# Altium schematic sheet GPS.SchDoc
size A4; SheetNumber: 8; SheetTotal: 13
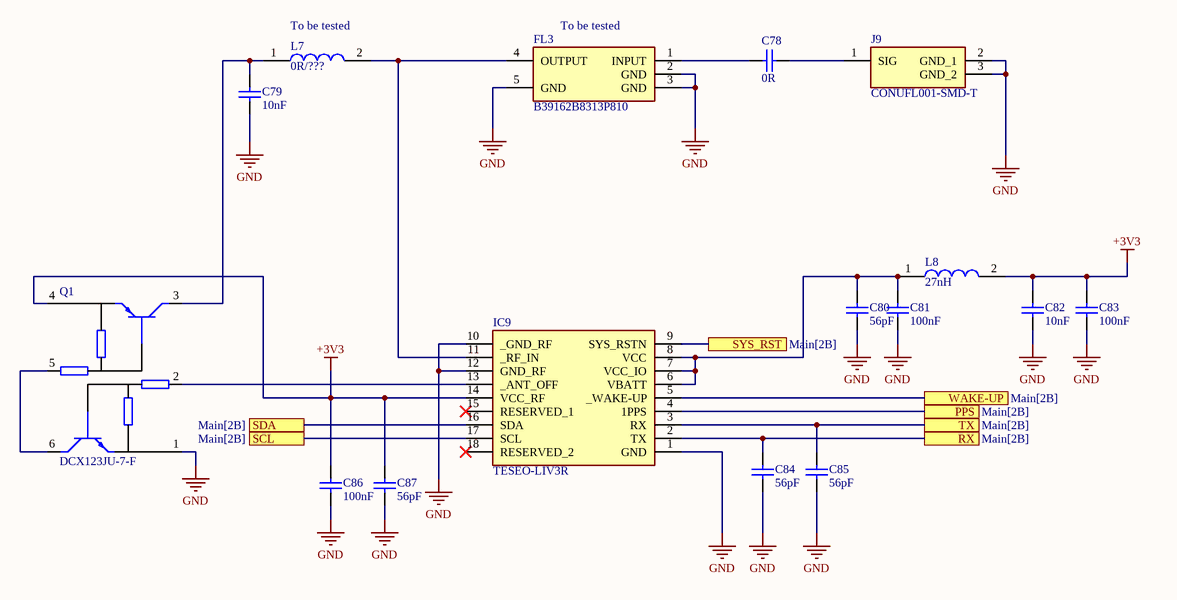
[diagram p0: GPS.SchDoc]

## Parts
C78  value 0R  [CAP0402]  (hidden comment: Cap0402)
C79  value 10nF  [CAP0402]  (hidden comment: Cap0402)
C80  value 56pF  [CAP0402]  (hidden comment: Cap0402)
C81  value 100nF  [CAP0402]  (hidden comment: Cap0402)
C82  value 10nF  [CAP0402]  (hidden comment: Cap0402)
C83  value 100nF  [CAP0402]  (hidden comment: Cap0402)
C84  value 56pF  [CAP0402]  (hidden comment: Cap0402)
C85  value 56pF  [CAP0402]  (hidden comment: Cap0402)
C86  value 100nF  [CAP0402]  (hidden comment: Cap0402)
C87  value 56pF  [CAP0402]  (hidden comment: Cap0402)
FL3  B39162B8313P810  [B39162B8313P810]
IC9  TESEO-LIV3R  [TESEOLIV3R]
J9  CONUFL001-SMD-T  [CONUFL001-SMD]
L7  value 0R/???  [INDC1005X55N]  (hidden comment: LQG15HS27NJ02)
L8  value 27nH  [INDC1005X55N]  (hidden comment: LQG15HS27NJ02)
Q1  DCX123JU-7-F  [SOT65P210X110-6N]

## Ports
PPS (see Main[2B]), RX (see Main[2B]), SCL (see Main[2B]), SDA (see Main[2B]), SYS_RST (see Main[2B]), TX (see Main[2B]), WAKE-UP (see Main[2B])

## Nets
+3V3: C82.2 C83.2 C86.2 C87.2 IC9.14(VCC_RF) L8.2 Q1.4(E)
GND: C79.1 C80.1 C81.1 C82.1 C83.1 C84.1 C85.1 C86.1 C87.1 FL3.2(GND) FL3.3(GND) FL3.5(GND) IC9.1(GND) IC9.10(_GND_RF) IC9.12(GND_RF) J9.2(GND_1) J9.3(GND_2) Q1.1(E)
PPS: IC9.4(1PPS) ; port PPS
RX: C84.2 IC9.2(TX) ; port RX
SCL: IC9.17(SCL) ; port SCL
SDA: IC9.16(SDA) ; port SDA
SYS_RST: IC9.9(SYS_RSTN) ; port SYS_RST
TX: C85.2 IC9.3(RX) ; port TX
WAKE-UP: IC9.5(_WAKE-UP) ; port WAKE-UP
NetC78_1: C78.1 J9.1(SIG)
NetC78_2: C78.2 FL3.1(INPUT)
NetC79_2: C79.2 L7.1 Q1.3(C)
NetC80_2: C80.2 C81.2 IC9.6(VBATT) IC9.7(VCC_IO) IC9.8(VCC) L8.1
NetFL3_4: FL3.4(OUTPUT) IC9.11(_RF_IN) L7.2
NetIC9_13: IC9.13(_ANT_OFF) Q1.2(B)
NetQ1_5: Q1.5(B) Q1.6(C)

Not connected (* = marked no-connect by the designer): IC9 15(RESERVED_1)* 18(RESERVED_2)*

## Notes on the sheet
- (near L7) To be tested
- (near FL3) To be tested

## Library data of the parts
C78 = Cap0402: RF NP0
C79 = Cap0402: RF NP0; Manufacturer_Part_Number: GRM1555CYA103GE01D; Voltage: 50V
C80 C84 C85 C87 = Cap0402: Manufacturer_Part_Number: GCM1555C1H560GA16D; Voltage: 50V
C81 C83 C86 = Cap0402: Manufacturer_Part_Number: GRM155R71H104ME14D; Voltage: 50V
C82 = Cap0402: Manufacturer_Part_Number: GRM155R71H103MA88D; Voltage: 50V
FL3 = B39162B8313P810: Filter; Manufacturer_Name: RF360; Datasheet Link: https://4donline.ihs.com/images/VipMasterIC/IC/TDKC/TDKC-S-A0001073526/TDKC-S-A0001073105-1.pdf?hkey=52A5661711E402568146F3353EA87419; Height: 0.4mm; Manufacturer_Part_Number: B39162B8313P810; Mouser Part Number: N/A; Mouser Price/Stock: https://www.mouser.co.uk/ProductDetail/RF360/B39162B8313P810?qs=%2Fd%252BFzHvH4c20Rngavm5AuA%3D%3D
IC9 = TESEO-LIV3R: Integrated Circuit; Manufacturer_Name: STMicroelectronics; Datasheet Link: https://www.st.com/resource/en/datasheet/teseo-liv3r.pdf; Height: 2.3mm; Manufacturer_Part_Number: TESEO-LIV3R; Mouser Part Number: 511-TESEO-LIV3R; Mouser Price/Stock: https://www.mouser.co.uk/ProductDetail/STMicroelectronics/TESEO-LIV3R?qs=ZSypp649SOXG7EmhCFcBlw%3D%3D; Arrow Part Number: TESEO-LIV3R; Arrow Price/Stock: https://www.arrow.com/en/products/teseo-liv3r/stmicroelectronics?region=nac
J9 = CONUFL001-SMD-T: Connector; Manufacturer_Name: Linx Technologies; Datasheet Link: https://linxtechnologies.com/wp/product/mhf-rf-connectors/; Manufacturer_Part_Number: CONUFL001-SMD-T; Mouser Part Number: 712-CONUFL001-SMD-T; Mouser Price/Stock: https://www.mouser.co.uk/ProductDetail/Linx-Technologies/CONUFL001-SMD-T?qs=EU6FO9ffTwfRdkBeQTdJWQ%3D%3D
L7 L8 = LQG15HS27NJ02: Inductor; Manufacturer_Part_Number: LQG15HS27NJ02
Q1 = DCX123JU-7-F: Transistor BJT PNP; Manufacturer_Name: Diodes Incorporated; Datasheet Link: https://www.diodes.com//assets/Datasheets/DCX_XXXX_U.pdf; Height: 1.1mm; Manufacturer_Part_Number: DCX123JU-7-F; Mouser Part Number: 621-DCX123JU-F; Mouser Price/Stock: https://www.mouser.co.uk/ProductDetail/Diodes-Incorporated/DCX123JU-7-F?qs=JodRp68BO%2F64PTlIzh5LEQ%3D%3D; Arrow Part Number: DCX123JU-7-F; Arrow Price/Stock: https://www.arrow.com/en/products/dcx123ju-7-f/diodes-incorporated